# Altium schematic sheet stm32f103cb_hm_F051.SchDoc: Schemat z procesorem STM32F051C8T6
size A4; DocumentNumber: 4; SheetNumber: 4; SheetTotal: 4; LotOfPieces: 1
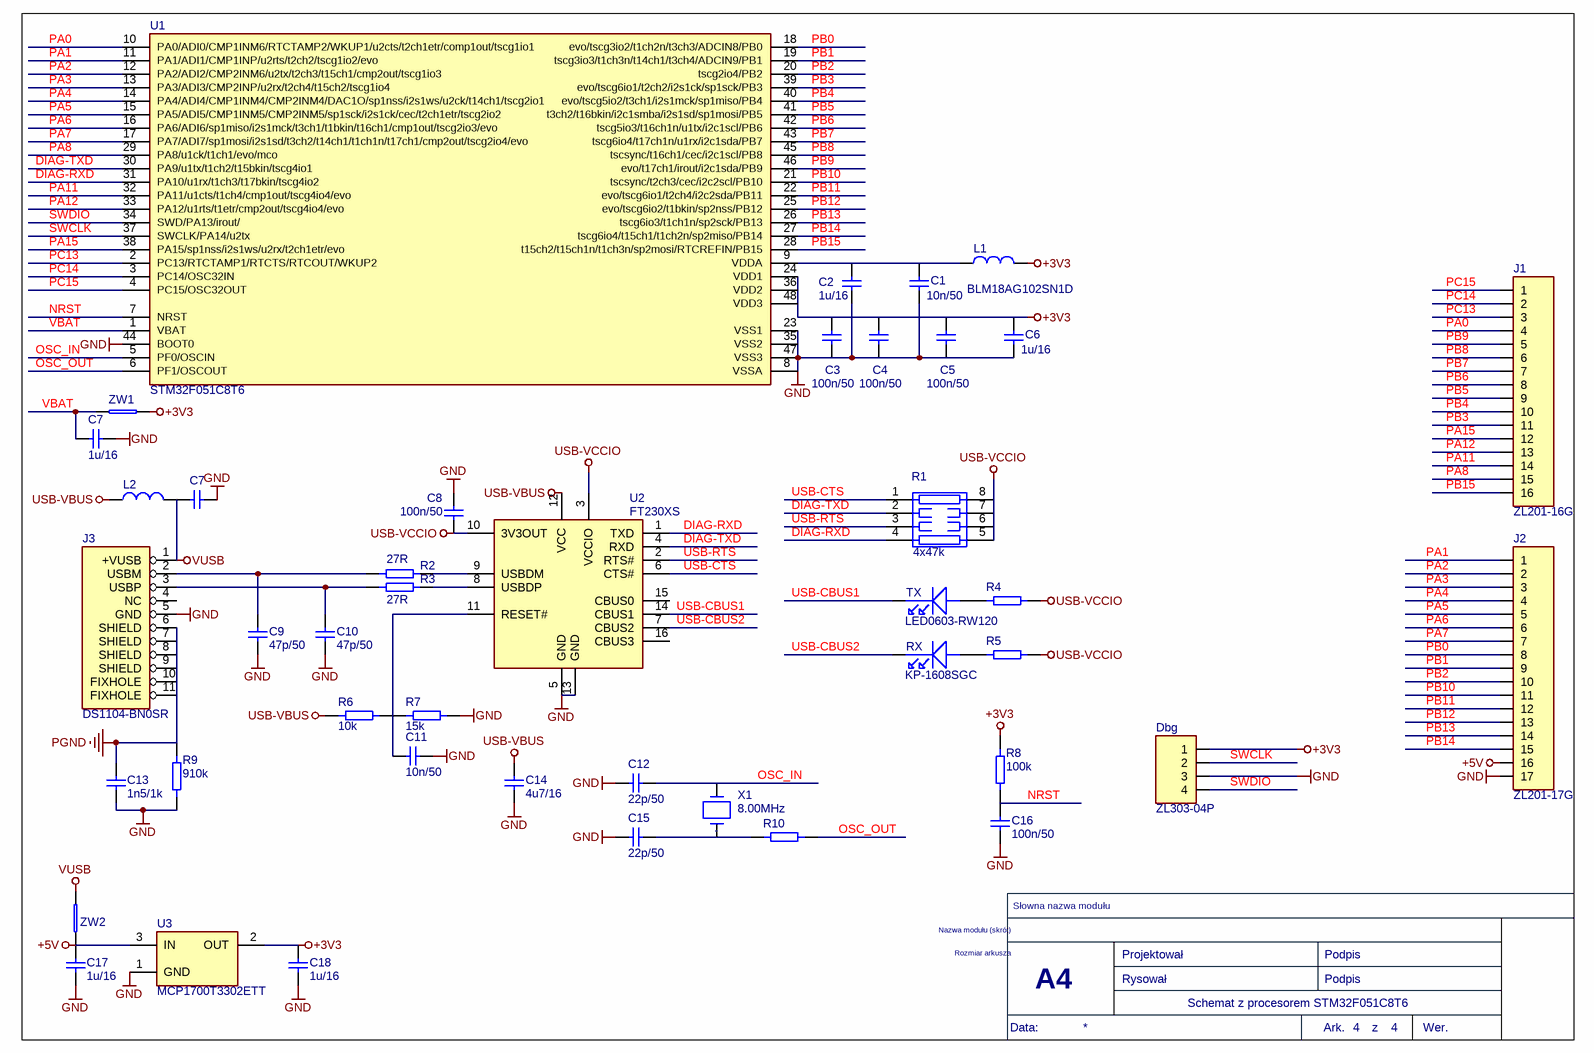
[diagram p0: stm32f103cb_hm_F051.SchDoc]

## Parts
(Parts that share a designator on the sheet are numbered #1, #2 ... from top to bottom, then left to right.)
C1  10n/50  [0603-IPC]  (graphical)
C2  1u/16  [0603-IPC]  (graphical)
C3  100n/50  [0603-IPC]  (graphical)
C4  100n/50  [0603-IPC]  (graphical)
C5  100n/50  [0603-IPC]  (graphical)
C6  1u/16  [0603-IPC]  (graphical)
C7#1  1u/16  [0603-IPC]  (graphical)
C7#2  10n/50  [0603-IPC]  (value not drawn)  (graphical)
C8  100n/50  [0603-IPC]  (graphical)
C9  47p/50  [0603-IPC]  (graphical)
C10  47p/50  [0603-IPC]  (graphical)
C11  10n/50  [0603-IPC]  (graphical)
C12  22p/50  [0603-IPC]  (graphical)
C13  1n5/1k  [1210]  (graphical)
C14  4u7/16  [0805]  (graphical)
C15  22p/50  [0603-IPC]  (graphical)
C16  100n/50  [0603-IPC]  (graphical)
C17  1u/16  [0603-IPC]  (graphical)
C18  1u/16  [0603-IPC]  (graphical)
Dbg  ZL303-04P  [PLMS4S]  (graphical)
J1  ZL201-16G  [PLS16S]  (graphical)
J2  ZL201-17G  [PLS17S]  (graphical)
J3  DS1104-BN0SR  [USBMS1B5]  (graphical)
L1  BLM18AG102SN1D  [0603-IPC]  (graphical)
L2  BLM18AG102SN1D  [0603-IPC]  (value not drawn)  (graphical)
R1  4x47k  [1206RP]  (graphical)
R2  27R  [0603R]  (graphical)
R3  27R  [0603R]  (graphical)
R4  10k  [0603R]  (value not drawn)  (graphical)
R5  10k  [0603R]  (value not drawn)  (graphical)
R6  10k  [0603R]  (graphical)
R7  15k  [0603R]  (graphical)
R8  100k  [0603R]  (graphical)
R9  910k  [2512]  (graphical)
R10  220R  [0603R]  (value not drawn)  (graphical)
RX  KP-1608SGC  [D0603]  (graphical)
TX  LED0603-RW120  [D0603]  (graphical)
U1  STM32F051C8T6  [MS-026ABC]  (graphical)
U2  FT230XS  [MO-137AB]  (graphical)
U3  MCP1700T3302ETT  [SOT23-3]  (graphical)
X1  8.00MHz  [HC49/4HSMX_THT]  (graphical)
ZW1  SHORT0805  [SHORT0805]  (value not drawn)  (graphical)
ZW2  SHORT0805  [SHORT0805]  (value not drawn)  (graphical)

## Nets
+3V3: C3.1 C4.1 C5.1 C6.1 C18.1 Dbg.1 L1.2 R8.1 U1.24(VDD1) U1.36(VDD2) U1.48(VDD3) U3.2(OUT) ZW1.2
+5V: C17.1 J2.16 U3.3(IN) ZW2.1
GND: C1.2 C2.2 C3.2 C4.2 C5.2 C6.2 C7#1.2 C7#2.1 C8.1 C9.2 C10.2 C11.1 C12.1 C13.2 C14.2 C15.1 C16.2 C17.2 C18.2 Dbg.3 J2.17 J3.5(GND) R7.2 R9.2 U1.8(VSSA) U1.23(VSS1) U1.35(VSS2) U1.44(BOOT0) U1.47(VSS3) U2.5(GND) U2.13(GND) U3.1(GND)
PGND: C13.1 J3.6(SHIELD) J3.7(SHIELD) J3.8(SHIELD) J3.9(SHIELD) J3.10(FIXHOLE) J3.11(FIXHOLE) R9.1
USB-VBUS: C14.1 L2.2 R6.1 U2.12(VCC)
USB-VCCIO: C8.2 R1.5(R5) R1.6(R6) R1.7(R7) R1.8(R8) R4.2 R5.2 U2.3(VCCIO) U2.10(3V3OUT)
VUSB: C7#2.2 J3.1(+VUSB) L2.1 ZW2.2
DIAG-RXD: R1.4(R4) U1.31(PA10/u1rx/t1ch3/t17bkin/tscg4io2) U2.1(TXD)
DIAG-TXD: R1.2(R2) U1.30(PA9/u1tx/t1ch2/t15bkin/tscg4io1) U2.4(RXD)
NRST: C16.1 R8.2 U1.7(NRST)
OSC_IN: C12.2 U1.5(PF0/OSCIN) X1.1
OSC_OUT: R10.2 U1.6(PF1/OSCOUT)
PA0: J1.4 U1.10(PA0/ADI0/CMP1INM6/RTCTAMP2/WKUP1/u2cts/t2ch1etr/comp1out/tscg1io1)
PA1: J2.1 U1.11(PA1/ADI1/CMP1INP/u2rts/t2ch2/tscg1io2/evo)
PA2: J2.2 U1.12(PA2/ADI2/CMP2INM6/u2tx/t2ch3/t15ch1/cmp2out/tscg1io3)
PA3: J2.3 U1.13(PA3/ADI3/CMP2INP/u2rx/t2ch4/t15ch2/tscg1io4)
PA4: J2.4 U1.14(PA4/ADI4/CMP1INM4/CMP2INM4/DAC1O/sp1nss/i2s1ws/u2ck/t14ch1/tscg2io1)
PA5: J2.5 U1.15(PA5/ADI5/CMP1INM5/CMP2INM5/sp1sck/i2s1ck/cec/t2ch1etr/tscg2io2)
PA6: J2.6 U1.16(PA6/ADI6/sp1miso/i2s1mck/t3ch1/t1bkin/t16ch1/cmp1out/tscg2io3/evo)
PA7: J2.7 U1.17(PA7/ADI7/sp1mosi/i2s1sd/t3ch2/t14ch1/t1ch1n/t17ch1/cmp2out/tscg2io4/evo)
PA8: J1.15 U1.29(PA8/u1ck/t1ch1/evo/mco)
PA11: J1.14 U1.32(PA11/u1cts/t1ch4/cmp1out/tscg4io4/evo)
PA12: J1.13 U1.33(PA12/u1rts/t1etr/cmp2out/tscg4io4/evo)
PA15: J1.12 U1.38(PA15/sp1nss/i2s1ws/u2rx/t2ch1etr/evo)
PB0: J2.8 U1.18(evo/tscg3io2/t1ch2n/t3ch3/ADCIN8/PB0)
PB1: J2.9 U1.19(tscg3io3/t1ch3n/t14ch1/t3ch4/ADCIN9/PB1)
PB2: J2.10 U1.20(tscg2io4/PB2)
PB3: J1.11 U1.39(evo/tscg6io1/t2ch2/i2s1ck/sp1sck/PB3)
PB4: J1.10 U1.40(evo/tscg5io2/t3ch1/i2s1mck/sp1miso/PB4)
PB5: J1.9 U1.41(t3ch2/t16bkin/i2c1smba/i2s1sd/sp1mosi/PB5)
PB6: J1.8 U1.42(tscg5io3/t16ch1n/u1tx/i2c1scl/PB6)
PB7: J1.7 U1.43(tscg6io4/t17ch1n/u1rx/i2c1sda/PB7)
PB8: J1.6 U1.45(tscsync/t16ch1/cec/i2c1scl/PB8)
PB9: J1.5 U1.46(evo/t17ch1/irout/i2c1sda/PB9)
PB10: J2.11 U1.21(tscsync/t2ch3/cec/i2c2scl/PB10)
PB11: J2.12 U1.22(evo/tscg6io1/t2ch4/i2c2sda/PB11)
PB12: J2.13 U1.25(evo/tscg6io2/t1bkin/sp2nss/PB12)
PB13: J2.14 U1.26(tscg6io3/t1ch1n/sp2sck/PB13)
PB14: J2.15 U1.27(tscg6io4/t15ch1/t1ch2n/sp2miso/PB14)
PB15: J1.16 U1.28(t15ch2/t15ch1n/t1ch3n/sp2mosi/RTCREFIN/PB15)
PC13: J1.3 U1.2(PC13/RTCTAMP1/RTCTS/RTCOUT/WKUP2)
PC14: J1.2 U1.3(PC14/OSC32IN)
PC15: J1.1 U1.4(PC15/OSC32OUT)
SWCLK: Dbg.2 U1.37(SWCLK/PA14/u2tx)
SWDIO: Dbg.4 U1.34(SWD/PA13/irout/)
USB-CBUS1: TX.CATH U2.14(CBUS1)
USB-CBUS2: RX.CATH U2.7(CBUS2)
USB-CTS: R1.1(R1) U2.6(CTS#)
USB-RTS: R1.3(R3) U2.2(RTS#)
VBAT: C7#1.1 U1.1(VBAT) ZW1.1
NetC1_1: C1.1 C2.1 L1.1 U1.9(VDDA)
NetC9_1: C9.1 J3.2(USBM) R2.1
NetC10_1: C10.1 J3.3(USBP) R3.1
NetC11_2: C11.2 R6.2 R7.1 U2.11(RESET#)
NetC15_2: C15.2 R10.1 X1.2
NetR2_2: R2.2 U2.9(USBDM)
NetR3_2: R3.2 U2.8(USBDP)
NetR4_1: R4.1 TX.ANOD
NetR5_1: R5.1 RX.ANOD

Not connected (* = marked no-connect by the designer): J3 4(NC); U2 15(CBUS0) 16(CBUS3)

## Notes on the sheet
- Nazwa modułu (skrót)
- Słowna nazwa modułu
- Rozmiar arkusza
- A4
- Projektował
- Rysował
- Podpis
- Data:
- Ark.
- z
- Wer.

## Library data of the parts
C1 C7#2 C11 = CAP20: Descript: Kondensator: ceramiczny; MLCC; 10nF; 50V; X7R; ±10%; SMD; 0603; Reference5: 06035C103KAT2A; Kod: CAP20; ID: 20; Value: 10n/50; Supplier5: tme.pl; Manufacturer5: AVX; Typ5: 06035C103KAT2A; Price5: 0,08; DateOfPrice5: 2020-05-10
C2 C6 C17 C18 = CAP37: Descript: Kondensator: ceramiczny; MLCC; 1uF; 16V; X7R; ±10%; SMD; 0603; Reference5: CL10B105KO8NNNC; Kod: CAP37; ID: 37; Value: 1u/16; Supplier5: tme.pl; Manufacturer5: Samsung; Typ5: CL10B105KO8NNNC; Price5: 0,07; DateOfPrice5: 2020-05-10
C3-C5 C8 C16 = CAP6: Descript: Kondensator: ceramiczny; MLCC; 100nF; 50V; X7R; ±5%; SMD; 0603; Reference5: CL10B104JB8NNNC; Kod: CAP6; ID: 6; Value: 100n/50; Supplier5: tme.pl; Manufacturer5: Samsung; Typ5: CL10B104JB8NNNC; Price5: 0,25; DateOfPrice5: 2020-05-10
C7#1 = CAP37: Kod: CAP37; ID: 37; Descript: Kondensator: ceramiczny; MLCC; 1uF; 16V; X7R; ±10%; SMD; 0603; Reference5: CL10B105KO8NNNC; Value: 1u/16; Price5: 0,07; DateOfPrice5: 2020-05-10; Supplier5: tme.pl; Manufacturer5: Samsung; Typ5: CL10B105KO8NNNC
C9 C10 = CAP85: Descript: Kondensator: ceramiczny; MLCC; 47pF; 50V; C0G; ±5%; SMD; 0603; Reference5: CC0603JRNPO9470; Typ5: CC0603JRNPO9BN470; Kod: CAP85; ID: 85; Value: 47p/50; Supplier5: tme.pl; Manufacturer5: Yageo; Price5: 0,08; DateOfPrice5: 2020-05-10
C12 C15 = CAP53: Descript: Kondensator: ceramiczny; MLCC; 22pF; 50V; C0G; ±5%; SMD; 0603; Reference5: CC0603JRNPO9220; Typ5: CC0603JRNPO9BN220; Kod: CAP53; ID: 53; Value: 22p/50; Supplier5: tme.pl; Manufacturer5: Yageo; Price5: 0; DateOfPrice5: 2010-01-01
C13 = CAP35: Descript: Ceramiczny kondensator wielowarstw. SMD, 1210 [jedn. metryczne: 3225], 1500 pF, 1 kV, ± 10%, X7R; Reference5: 1855964; Typ5: MCCA000836; Kod: CAP35; ID: 35; Value: 1n5/1k; DateOfPrice5: 2020-05-10; Manufacturer5: MULTICOMP; Price5: 2,4; Supplier5: farnell.com
C14 = CAP97: Descript: Kondensator: ceramiczny; MLCC; 4,7uF; 16VDC; X7R; ±5%; SMD; 0805; Reference5: C0805C475J4RACAUTO; Kod: CAP97; ID: 97; Value: 4u7/16; Supplier5: tme.pl; Manufacturer5: Kemet; Typ5: C0805C475J4RACAUTO; Price5: 1,5; DateOfPrice5: 2020-05-10
Dbg = Con298: Descript: Listwa kołkowa; kołkowe; męskie; PIN:4; proste; 2mm; THT; 1x4; Kod: Con298; ID: 298; Replacement: bd; Value: ZL303-04P; Supplier5: tme.pl; Reference5: ZL303-04P; Manufacturer5: Ninigi; Typ5: ZL303-04P; Price5: 0,2; DateOfPrice5: 2020-05-10
J1 = CON81: Kod: CON81; ID: 81; Descript: Listwa kołkowa; kołkowe; męskie; PIN: 16; proste; 2,54mm; THT; 1x16; Typ5: DS1021-1*16SF11; Replacement: bd; Value: ZL201-16G; Price5: 0,7; DateOfPrice5: 2020-12-08; Supplier5: tme; Reference5: ZL201-16G; Manufacturer5: Connfly
J2 = CON82: Kod: CON82; ID: 82; Descript: Listwa kołkowa; kołkowe; męskie; PIN: 20; proste; 2,54mm; THT; 1x20; Reference5: ZL201-20G; Typ5: DS1021-1*20SF11; Replacement: bd; Value: ZL201-17G; Price5: 1; DateOfPrice5: 2020-12-08; Supplier5: tme; Manufacturer5: Connfly
J3 = Con41: Descript: Gniazdo; USB B mini; SMT; PIN: 5; poziome; Opakowanie: taśma; Reference5: MUSB-G5P; Replacement: bd; Kod: Con41; ID: 41; Value: DS1104-BN0SR; Supplier5: tme.pl; Manufacturer5: Connfly; Price5: 2; DateOfPrice5: 2010-01-01; Typ5: DS1104-BN0SR
L1 L2 = Ind41: Descript: Ferryt: koralik; Imp.@ 100MHz:1000om; Montaż: SMD; 0,4A; Obud:0603; Kod: Ind41; ID: 41; Value: BLM18AG102SN1D; Supplier5: tme.pl; Reference5: BLM18AG102SN1D; Manufacturer5: Murata; Typ5: BLM18AG102SN1D; Price5: 0; DateOfPrice5: 2020-05-10; InductCurr: -
R1 = Res182: Descript: Drabinka rezystorowa: Y; 47kΩ; SMD; 1206; Il.rezystorów:4; 63mW; Reference5: DR1206-47K-4/8; Typ5: 4D03WGJ0473T; Kod: Res182; ID: 182; Value: 4x47k; Supplier5: tme.pl; Manufacturer5: Royal Ohm; Price5: 0,1; DateOfPrice5: 2020-05-10
R2 R3 = Res106: Descript: Rezystor: thick film; SMD; 0603; 27Ω; 0,1W; ±1%; -55÷125°C; Reference5: SMD0603-27R-1%; Typ5: 0603SAF270JT5E; Kod: Res106; ID: 106; Value: 27R; Supplier5: tme.pl; Manufacturer5: Royal Ohm; Price5: 0,1; DateOfPrice5: 2020-05-10
R4-R6 = Res15: Descript: Rezystor: thick film; SMD; 0603; 10kom; 0,1W; ±1%; -55÷125°C; Reference5: SMD0603-10K-1%; Typ5: 0603WGF 10K T5E; Kod: Res15; ID: 15; Value: 10k; Supplier5: tme.pl; Manufacturer5: Royal Ohm; Price5: 0,08; DateOfPrice5: 2020-05-10
R7 = Res39: Descript: Rezystor: thick film; SMD; 0603; 15kΩ; 0,1W; ±1%; -55÷125°C; Reference5: SMD0603-15K-1%; Typ5: 0603WGF15KT5E; Kod: Res39; ID: 39; Value: 15k; Supplier5: tme.pl; Manufacturer5: Royal Ohm; Price5: 0,08; DateOfPrice5: 2020-05-10
R8 = Res9: Descript: Rezystor: thick film; SMD; 0603; 100kom; 0,1W; ±1%; -55÷125°C; Reference5: SMD0603-100K-1%; Typ5: 0603SAF1003T5E; Kod: Res9; ID: 9; Value: 100k; Supplier5: tme.pl; Manufacturer5: Royal Ohm; Price5: 0,1; DateOfPrice5: 2020-06-25
R9 = Res235: Descript: Rezystor SMD, grubowarstwowy, 2512 [jedn. metryczne: 6432], 910 kohm, Seria ERJU1T, 200 V; Reference5: 2381073; Typ5: ERJU1TF9103U; Kod: Res235; ID: 235; Value: 910k; Supplier5: farnell; Price5: 1,14; DateOfPrice5: 2020-05-10; Manufacturer5: Panasonic
R10 = Res87: Descript: Rezystor: thick film; SMD; 0603; 220om; 0,1W; ±1%; -55÷125°C; Reference5: SMD0603-220R-1%; Typ5: 0603SAF2200T5E; Kod: Res87; ID: 87; Value: 220R; Supplier5: tme.pl; Manufacturer5: Royal Ohm; Price5: 0,1; DateOfPrice5: 2020-06-25
RX = Opt8: Descript: LED; SMD; 0603; zielony; 4-15mcd; 120°; 1,6x0,8mm; Kod: Opt8; ID: 8; Value: KP-1608SGC; Supplier5: tme.pl; Reference5: KP-1608SGC; Manufacturer5: Kingbright Electronic; Typ5: KP-1608SGC; Price5: 0,8; DateOfPrice5: 2020-05-10
TX = Opt25: Descript: Dioda LED, SMD 0603, Czerwona 626-636nm, 50-70 mCd /10mA, water clear, 120°; Kod: Opt25; ID: 25; Value: LED0603-RW120; Supplier5: maritex.com.pl; Reference5: LED0603-RW120; Typ5: LED0603-RW120; Price5: 0,12; DateOfPrice5: 2020-05-10; Manufacturer5: Honglitronic
U1 = ICs112: Kod: ICs112; ID: 112; Descript: Mikrokontroler ARM Cortex M0; Flash:64kB; 48MHz; SRAM:8kB; Reference5: 497-12893-ND; Value: STM32F051C8T6; Price5: 16; DateOfPrice5: 2020-12-13; Supplier5: digikey; Manufacturer5: ST; Typ5: STM32F051C8T6
U2 = ICs109: Descript: Interfejs; USB-basic UART; Ilość pinów CBUS:4; tuba; SSOP16; Reference5: FT230XS-R; Kod: ICs109; ID: 109; Value: FT230XS; Supplier5: tme.pl; Manufacturer5: FTDI; Typ5: FT230XS-R; Price5: 8,8; DateOfPrice5: 2020-05-10
U3 = ICs182: Kod: ICs182; ID: 182; Descript: Stabilizator napięcia; LDO, nieregulowany; 3,3V; 0,25A; SOT23-3; Typ5: MCP1700T3302E/TT; Value: MCP1700T3302ETT; Price5: 1,8; DateOfPrice5: 2020-05-10; Supplier5: tme.pl; Reference5: MCP1700T3302ETT; Manufacturer5: Microchip
X1 = Qua16: Descript: Rezonator: kwarcowy; 8MHz; ±30ppm; 20pF; SMD; HC49SM; Reference5: 8.00M-SMDHC49S; Kod: Qua16; ID: 16; Value: 8.00MHz; Supplier5: tme.pl; Manufacturer5: YIC; Price5: 2; DateOfPrice5: 2020-05-10; Freq: -
ZW1 ZW2 = Res238: Kod: Res238; ID: 238; Descript: Przewlekana zwora z drutu na planie rezystora 0805; Value: SHORT0805; Price5: 0,1; Supplier5: -; Reference5: -; Manufacturer5: -; Typ5: -